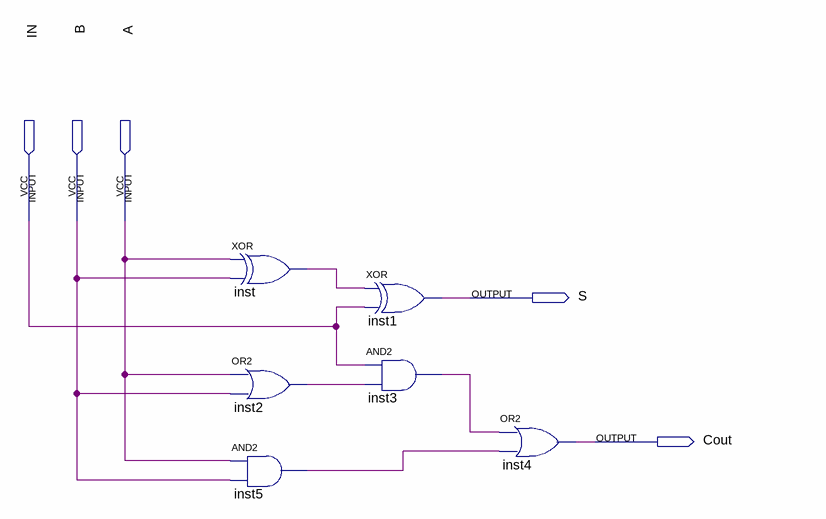
[diagram p0: schematic sheet]
// Quartus schematic fa.bdf as structural Verilog: 6 symbols, 5 pins
module fa (
  input  IN,
  input  B,
  input  A,
  output S,
  output Cout
);

  wire inst2_out, inst3_out, inst5_out, inst_out;

  xor inst (inst_out, A, B);
  or inst2 (inst2_out, A, B);
  and inst5 (inst5_out, A, B);
  xor inst1 (S, inst_out, IN);
  and inst3 (inst3_out, IN, inst2_out);
  or inst4 (Cout, inst3_out, inst5_out);
endmodule
